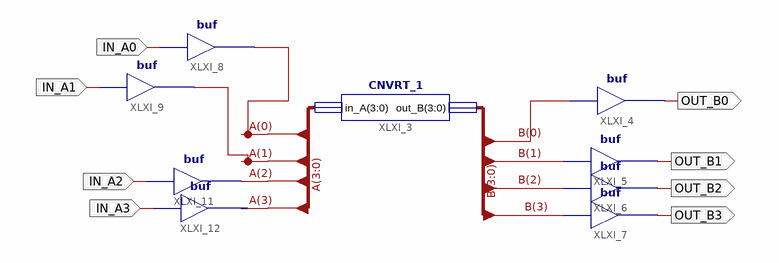
[diagram p0: schematic sheet 1]
// Xilinx ISE schematic cnvert_2.sch (spartan3e) as structural Verilog: 9 symbols, 8 ports
module cnvert_2 (
  input  IN_A0,
  input  IN_A1,
  input  IN_A2,
  input  IN_A3,
  output OUT_B0,
  output OUT_B1,
  output OUT_B2,
  output OUT_B3
);

  wire [3:0] A, B;

  CNVRT_1 XLXI_3 (.in_A(A), .out_B(B));
  buf XLXI_4 (OUT_B0, B[0]);
  buf XLXI_5 (OUT_B1, B[1]);
  buf XLXI_6 (OUT_B2, B[2]);
  buf XLXI_7 (OUT_B3, B[3]);
  buf XLXI_8 (A[0], IN_A0);
  buf XLXI_9 (A[1], IN_A1);
  buf XLXI_11 (A[2], IN_A2);
  buf XLXI_12 (A[3], IN_A3);
endmodule
